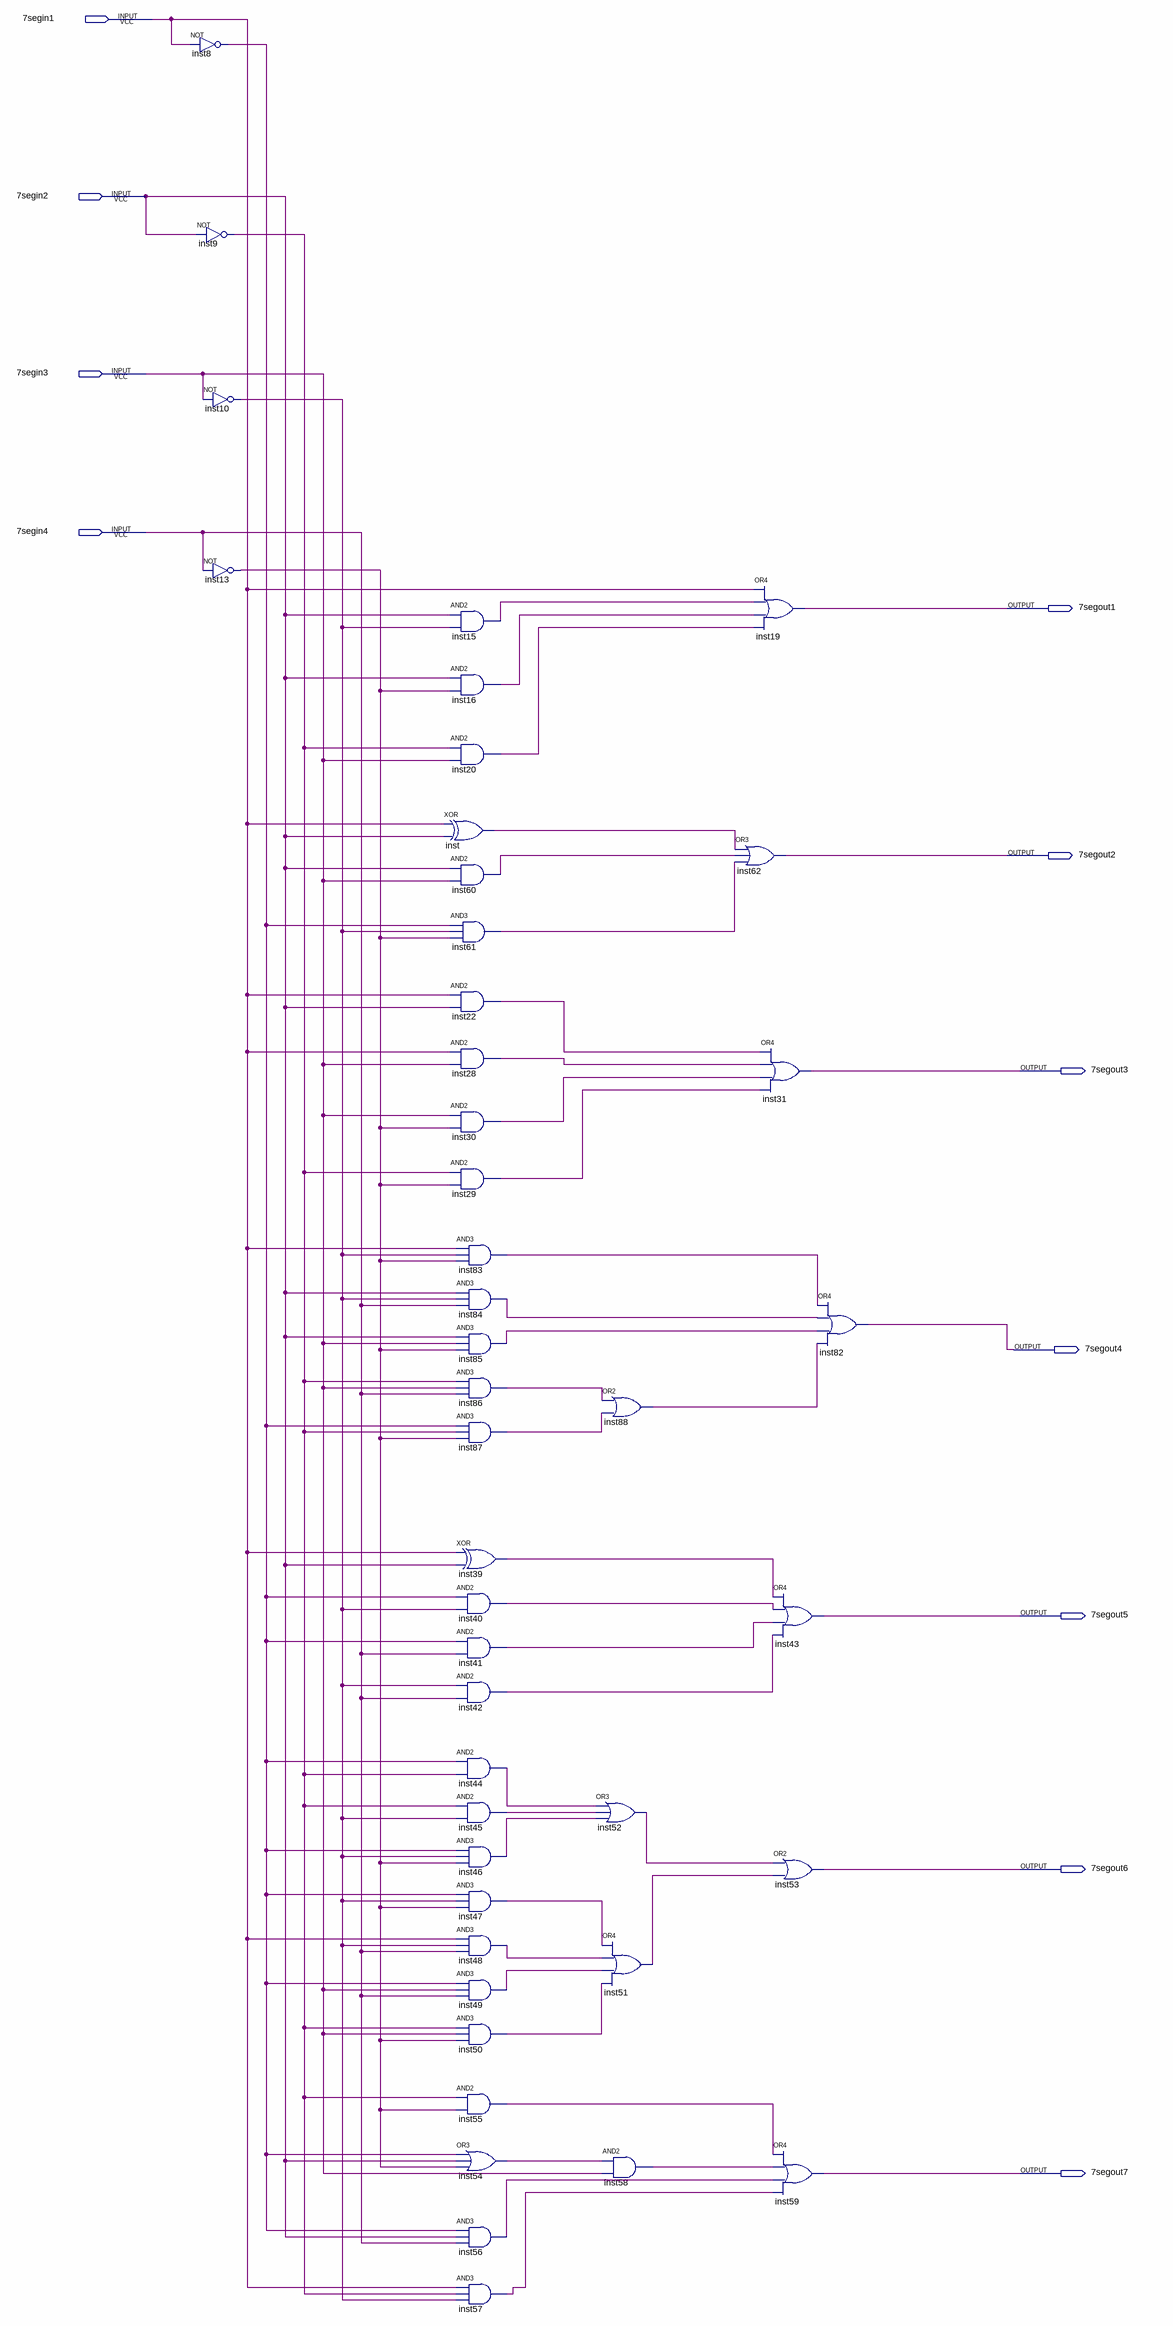
[diagram p0: schematic sheet]
// Quartus schematic 7seg.bdf as structural Verilog: 45 symbols, 11 pins
module \7seg  (
  input  \7segin1 ,
  input  \7segin2 ,
  input  \7segin3 ,
  input  \7segin4 ,
  output \7segout1 ,
  output \7segout2 ,
  output \7segout3 ,
  output \7segout4 ,
  output \7segout5 ,
  output \7segout6 ,
  output \7segout7 
);

  wire inst8_out, inst9_out, inst10_out, inst13_out, inst15_out, inst16_out, inst20_out, inst22_out,
       inst28_out, inst29_out, inst30_out, inst39_out, inst40_out, inst41_out, inst42_out, inst44_out,
       inst45_out, inst46_out, inst47_out, inst48_out, inst49_out, inst50_out, inst51_out, inst52_out,
       inst54_out, inst55_out, inst56_out, inst57_out, inst58_out, inst60_out, inst61_out, inst83_out,
       inst84_out, inst85_out, inst86_out, inst87_out, inst88_out, inst_out;

  not inst8 (inst8_out, \7segin1 );
  not inst9 (inst9_out, \7segin2 );
  not inst10 (inst10_out, \7segin3 );
  not inst13 (inst13_out, \7segin4 );
  xor inst (inst_out, \7segin1 , \7segin2 );
  and inst15 (inst15_out, \7segin2 , inst10_out);
  and inst16 (inst16_out, \7segin2 , inst13_out);
  and inst20 (inst20_out, inst9_out, \7segin3 );
  and inst60 (inst60_out, \7segin2 , \7segin3 );
  and inst61 (inst61_out, inst8_out, inst10_out, inst13_out);
  and inst22 (inst22_out, \7segin1 , \7segin2 );
  and inst28 (inst28_out, \7segin1 , \7segin3 );
  and inst30 (inst30_out, \7segin3 , inst13_out);
  and inst29 (inst29_out, inst9_out, inst13_out);
  and inst83 (inst83_out, \7segin1 , inst10_out, inst13_out);
  and inst84 (inst84_out, \7segin2 , inst10_out, \7segin4 );
  and inst85 (inst85_out, \7segin2 , \7segin3 , inst13_out);
  and inst86 (inst86_out, inst9_out, \7segin3 , \7segin4 );
  and inst87 (inst87_out, inst8_out, inst9_out, inst13_out);
  xor inst39 (inst39_out, \7segin1 , \7segin2 );
  and inst40 (inst40_out, inst8_out, inst10_out);
  and inst41 (inst41_out, inst8_out, \7segin4 );
  and inst42 (inst42_out, inst10_out, \7segin4 );
  and inst44 (inst44_out, inst8_out, inst9_out);
  and inst45 (inst45_out, inst9_out, inst10_out);
  and inst46 (inst46_out, inst8_out, inst10_out, inst13_out);
  and inst47 (inst47_out, inst8_out, inst10_out, inst13_out);
  and inst48 (inst48_out, \7segin1 , inst10_out, \7segin4 );
  and inst49 (inst49_out, inst8_out, \7segin3 , \7segin4 );
  and inst50 (inst50_out, inst9_out, \7segin3 , inst13_out);
  and inst55 (inst55_out, inst9_out, inst13_out);
  or inst54 (inst54_out, inst8_out, \7segin2 , inst13_out);
  and inst56 (inst56_out, inst8_out, \7segin2 , \7segin4 );
  and inst57 (inst57_out, \7segin1 , inst9_out, inst10_out);
  or inst52 (inst52_out, inst44_out, inst45_out, inst46_out);
  or inst88 (inst88_out, inst86_out, inst87_out);
  or inst51 (inst51_out, inst47_out, inst48_out, inst49_out, inst50_out);
  and inst58 (inst58_out, inst54_out, \7segin3 );
  or inst62 (\7segout2 , inst_out, inst60_out, inst61_out);
  or inst19 (\7segout1 , \7segin1 , inst15_out, inst16_out, inst20_out);
  or inst31 (\7segout3 , inst22_out, inst28_out, inst30_out, inst29_out);
  or inst43 (\7segout5 , inst39_out, inst40_out, inst41_out, inst42_out);
  or inst53 (\7segout6 , inst52_out, inst51_out);
  or inst59 (\7segout7 , inst55_out, inst58_out, inst56_out, inst57_out);
  or inst82 (\7segout4 , inst83_out, inst84_out, inst85_out, inst88_out);
endmodule
